# Altium schematic sheet IMX8_INTERFACE.SchDoc
size 594 x 420 mm; SheetNumber: 2; SheetTotal: 12
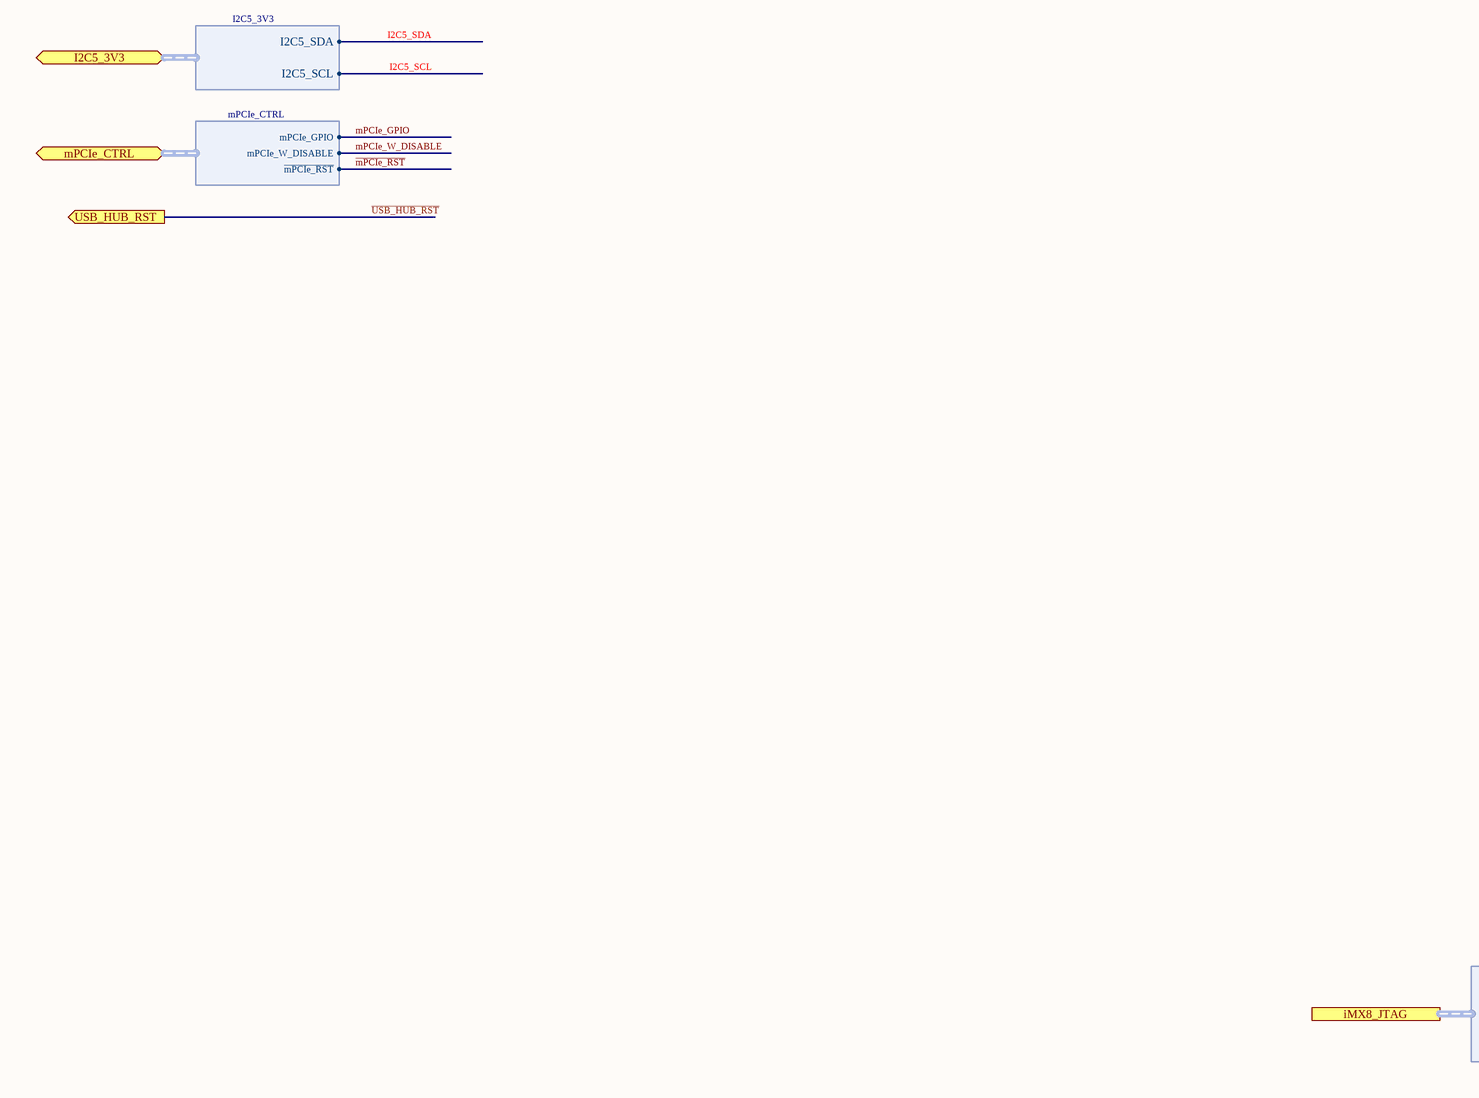
[diagram p0: IMX8_INTERFACE.SchDoc, bottom left]
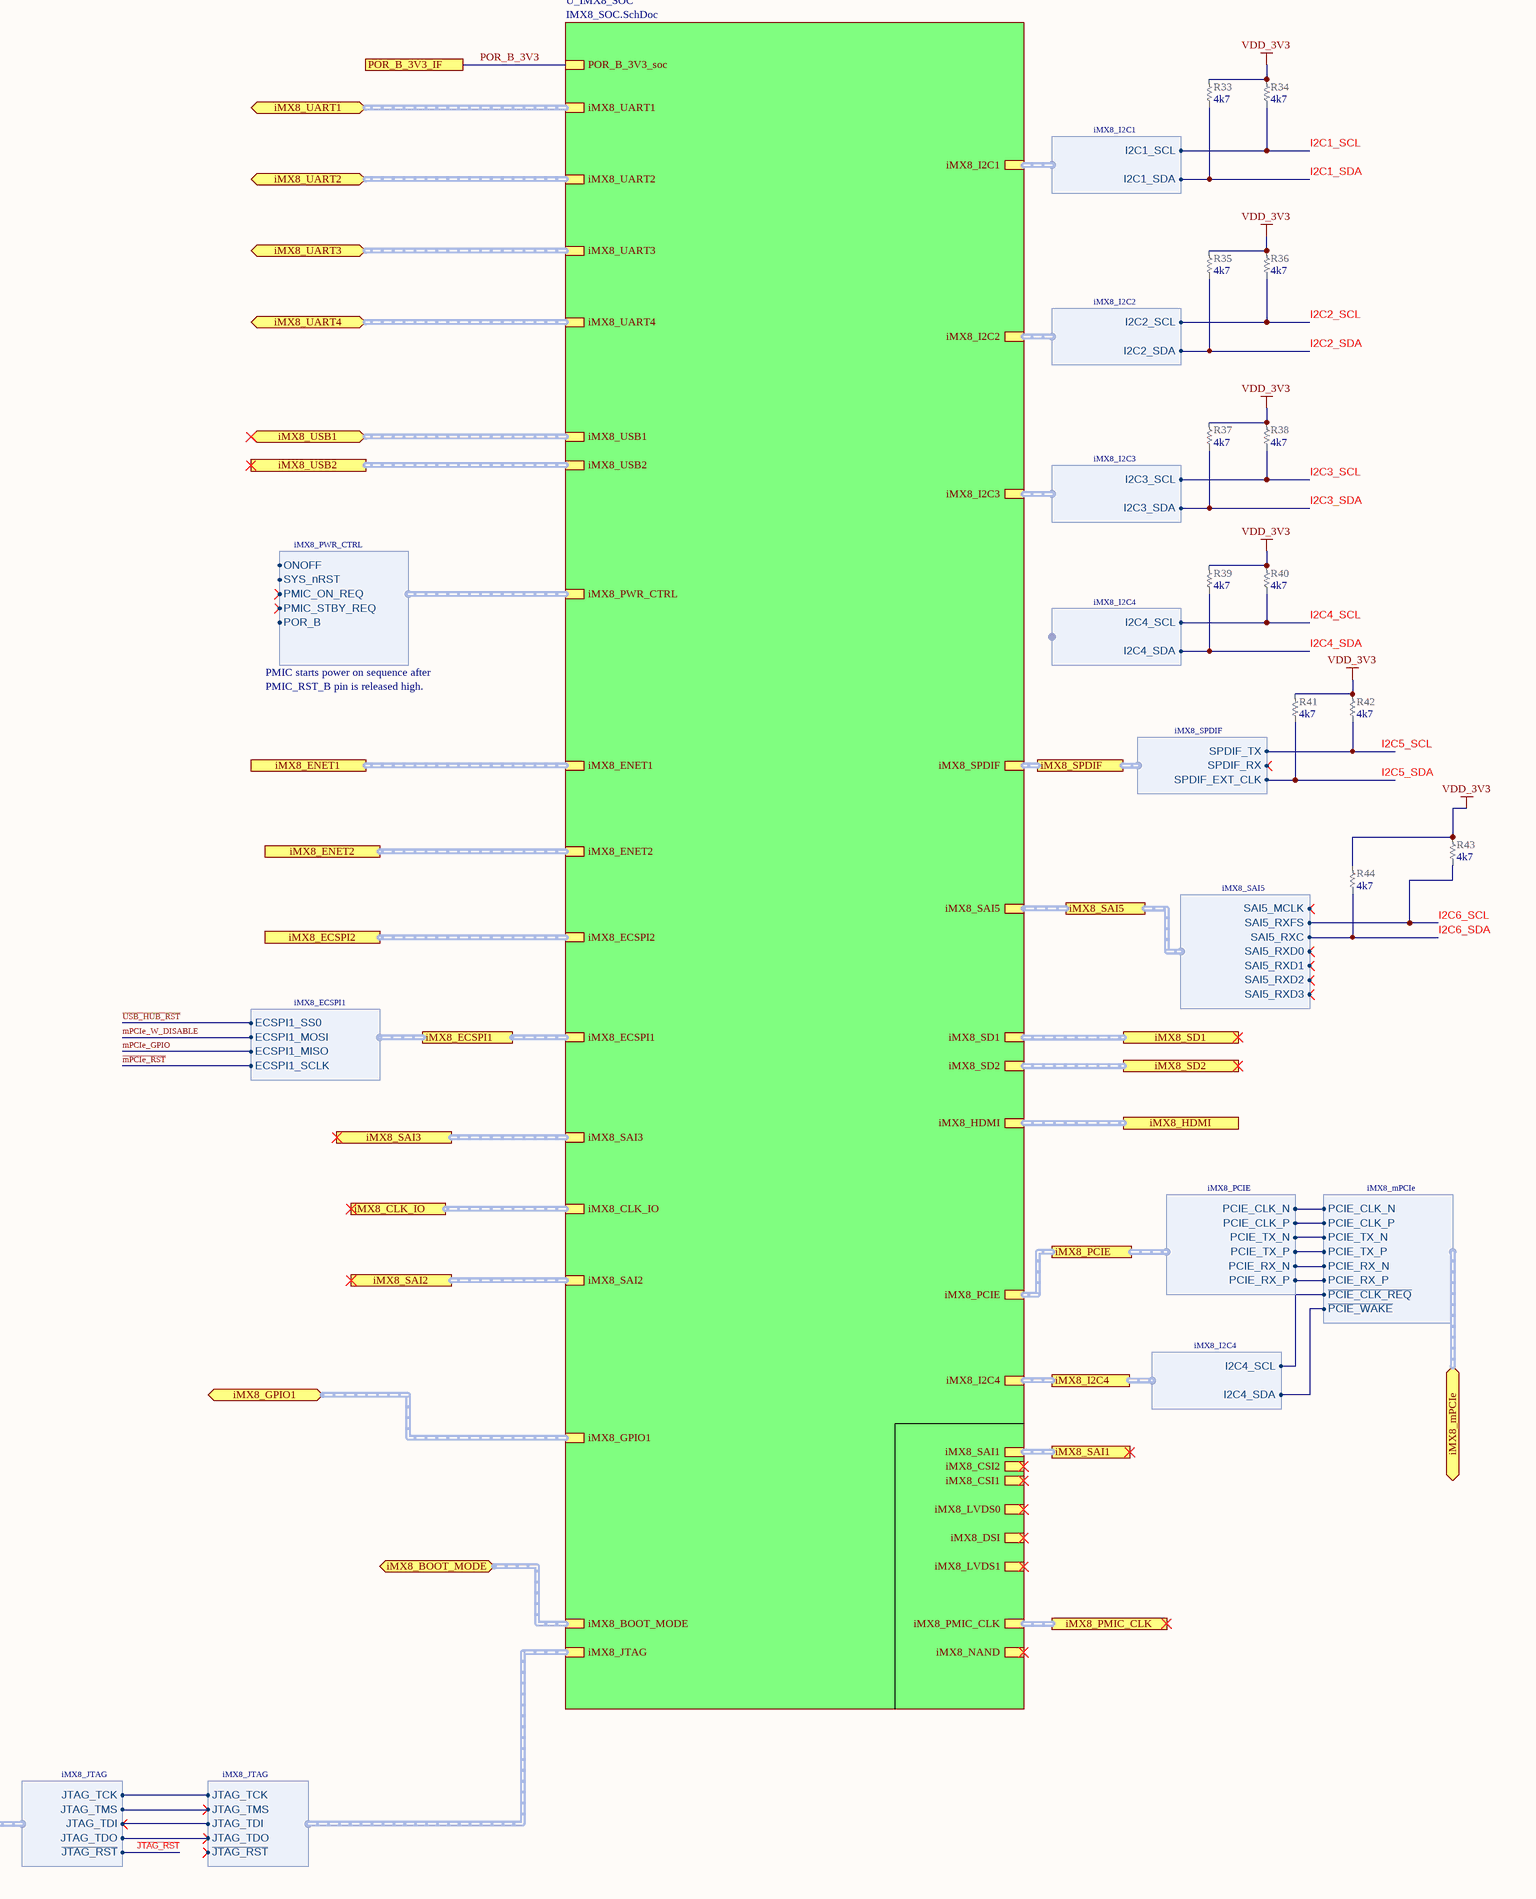
[diagram p1: IMX8_INTERFACE.SchDoc, bottom right]

## Parts
R33  value 4k7  [RES_0201_UN1Q]  (hidden comment: RES_0201_4k7)
R34  value 4k7  [RES_0201_UN1Q]  (hidden comment: RES_0201_4k7)
R35  value 4k7  [RES_0201_UN1Q]  (hidden comment: RES_0201_4k7)
R36  value 4k7  [RES_0201_UN1Q]  (hidden comment: RES_0201_4k7)
R37  value 4k7  [RES_0201_UN1Q]  (hidden comment: RES_0201_4k7)
R38  value 4k7  [RES_0201_UN1Q]  (hidden comment: RES_0201_4k7)
R39  value 4k7  [RES_0201_UN1Q]  (hidden comment: RES_0201_4k7)
R40  value 4k7  [RES_0201_UN1Q]  (hidden comment: RES_0201_4k7)
R41  value 4k7  [RES_0201_UN1Q]  (hidden comment: RES_0201_4k7)
R42  value 4k7  [RES_0201_UN1Q]  (hidden comment: RES_0201_4k7)
R43  value 4k7  [RES_0201_UN1Q]  (hidden comment: RES_0201_4k7)
R44  value 4k7  [RES_0201_UN1Q]  (hidden comment: RES_0201_4k7)

## Sub-sheets
U_IMX8_SOC = IMX8_SOC.SchDoc: iMX8_USB1 (harness iMX8_USB1), iMX8_USB2 (harness iMX8_USB2), iMX8_SD1 (harness iMX8_SD1), iMX8_SD2 (harness iMX8_SD2), iMX8_NAND (harness iMX8_PCIE), iMX8_PCIE (harness iMX8_PCIE), iMX8_DSI (harness iMX8_DSI), iMX8_LVDS0 (harness iMX8_LVDS0), iMX8_LVDS1 (harness iMX8_LVDS1), iMX8_CSI1 (harness iMX8_CSI1), iMX8_CSI2 (harness iMX8_CSI2), iMX8_HDMI (harness iMX8_HDMI), iMX8_UART1 (harness iMX8_UART1), iMX8_UART2 (harness iMX8_UART2), iMX8_UART3 (harness iMX8_UART3), iMX8_UART4 (harness iMX8_UART4), iMX8_I2C1 (harness iMX8_I2C1), iMX8_I2C2 (harness iMX8_I2C2), iMX8_I2C3 (harness iMX8_I2C3), iMX8_SAI1 (harness iMX8_SAI1), iMX8_SAI2 (harness iMX8_SAI2), iMX8_SAI5 (harness iMX8_SAI5), iMX8_SAI3 (harness iMX8_SAI3), iMX8_ENET1, iMX8_ENET2 (harness iMX8_ENET), iMX8_ECSPI2 (harness iMX8_ECSPI2), iMX8_GPIO1 (harness iMX8_GPIO1), iMX8_SPDIF (harness iMX8_SPDIF), iMX8_BOOT_MODE (harness iMX8_BOOT_MODE), iMX8_JTAG (harness iMX8_JTAG), iMX8_PMIC_CLK (harness iMX8_PMIC_CLK), iMX8_PWR_CTRL (harness iMX8_PWR_CTRL), iMX8_I2C4 (harness iMX8_I2C4), iMX8_ECSPI1 (harness iMX8_ECSPI1), POR_B_3V3_soc, iMX8_CLK_IO (harness iMX8_CLK_IO_sub)

## Ports
I2C5_3V3 (bidir, harness I2C5_3V3), iMX8_BOOT_MODE (bidir, harness iMX8_BOOT_MODE), iMX8_CLK_IO (harness iMX8_CLK_IO_sub), iMX8_ECSPI1 (harness iMX8_ECSPI1), iMX8_ECSPI2 (harness iMX8_ECSPI2), iMX8_ENET1, iMX8_ENET2 (harness iMX8_ENET), iMX8_GPIO1 (bidir, harness iMX8_GPIO1), iMX8_HDMI (harness iMX8_HDMI), iMX8_I2C4 (harness iMX8_I2C4), iMX8_JTAG (harness iMX8_JTAG), iMX8_mPCIe (bidir, harness iMX8_mPCIe), iMX8_PCIE (harness iMX8_PCIE), iMX8_PMIC_CLK (harness iMX8_PMIC_CLK), iMX8_SAI1 (harness iMX8_SAI1), iMX8_SAI2 (harness iMX8_SAI2), iMX8_SAI3 (harness iMX8_SAI3), iMX8_SAI5 (harness iMX8_SAI5), iMX8_SD1 (harness iMX8_SD1), iMX8_SD2 (harness iMX8_SD2), iMX8_SPDIF (harness iMX8_SPDIF), iMX8_UART1 (bidir, harness iMX8_UART1), iMX8_UART2 (bidir, harness iMX8_UART2), iMX8_UART3 (bidir, harness iMX8_UART3), iMX8_UART4 (bidir, harness iMX8_UART4), iMX8_USB1 (bidir, harness iMX8_USB1), iMX8_USB2 (harness iMX8_USB2), mPCIe_CTRL (bidir, harness mPCIe_CTRL), POR_B_3V3_IF, USB_HUB_RST (out)

## Harnesses
iMX8_JTAG: JTAG_TCK, JTAG_TMS, JTAG_TDI, JTAG_TDO, ~{JTAG_RST}
iMX8_PWR_CTRL: ONOFF, POR_B, PMIC_ON_REQ, PMIC_STBY_REQ, SYS_nRST
iMX8_I2C1: I2C1_SCL, I2C1_SDA
iMX8_I2C2: I2C2_SCL, I2C2_SDA
iMX8_I2C3: I2C3_SCL, I2C3_SDA
iMX8_I2C4: I2C4_SCL, I2C4_SDA
iMX8_SAI5: SAI5_MCLK, SAI5_RXFS, SAI5_RXC, SAI5_RXD0, SAI5_RXD1, SAI5_RXD2, SAI5_RXD3
iMX8_SPDIF: SPDIF_TX, SPDIF_RX, SPDIF_EXT_CLK
I2C5_3V3: I2C5_SDA, I2C5_SCL
iMX8_PCIE: PCIE_CLK_N, PCIE_CLK_P, PCIE_TX_N, PCIE_TX_P, PCIE_RX_N, PCIE_RX_P
iMX8_mPCIe: PCIE_CLK_N, PCIE_CLK_P, PCIE_TX_N, PCIE_TX_P, PCIE_RX_N, PCIE_RX_P, ~{PCIE_CLK_REQ}, ~{PCIE_WAKE}
mPCIe_CTRL: mPCIe_GPIO, ~{mPCIe_RST}, mPCIe_W_DISABLE
iMX8_ECSPI1: ECSPI1_SS0, ECSPI1_MOSI, ECSPI1_MISO, ECSPI1_SCLK

## Nets
VDD_3V3: R33.2 R34.2 R35.2 R36.2 R37.2 R38.2 R39.2 R40.2 R41.2 R42.2 R43.2 R44.2
~{JTAG_RST}: port iMX8_JTAG.~{JTAG_RST}
~{mPCIe_RST}: port mPCIe_CTRL.~{mPCIe_RST}, port iMX8_ECSPI1.ECSPI1_SCLK
~{USB_HUB_RST}: port USB_HUB_RST, port iMX8_ECSPI1.ECSPI1_SS0
I2C1_SCL: R34.1 ; sheet U_IMX8_SOC/iMX8_I2C1.I2C1_SCL
I2C1_SDA: R33.1 ; sheet U_IMX8_SOC/iMX8_I2C1.I2C1_SDA
I2C2_SCL: R36.1 ; sheet U_IMX8_SOC/iMX8_I2C2.I2C2_SCL
I2C2_SDA: R35.1 ; sheet U_IMX8_SOC/iMX8_I2C2.I2C2_SDA
I2C3_SCL: R38.1 ; sheet U_IMX8_SOC/iMX8_I2C3.I2C3_SCL
I2C3_SDA: R37.1 ; sheet U_IMX8_SOC/iMX8_I2C3.I2C3_SDA
I2C4_SCL: R40.1 ; harness iMX8_I2C4.I2C4_SCL
I2C4_SDA: R39.1 ; harness iMX8_I2C4.I2C4_SDA
I2C5_SCL: R42.1 ; port iMX8_SPDIF.SPDIF_TX, port I2C5_3V3.I2C5_SCL
I2C5_SDA: R41.1 ; port iMX8_SPDIF.SPDIF_EXT_CLK, port I2C5_3V3.I2C5_SDA
I2C6_SCL: R43.1 ; port iMX8_SAI5.SAI5_RXFS
I2C6_SDA: R44.1 ; port iMX8_SAI5.SAI5_RXC
mPCIe_GPIO: port mPCIe_CTRL.mPCIe_GPIO, port iMX8_ECSPI1.ECSPI1_MISO
mPCIe_W_DISABLE: port mPCIe_CTRL.mPCIe_W_DISABLE, port iMX8_ECSPI1.ECSPI1_MOSI
POR_B_3V3: port POR_B_3V3_IF, sheet U_IMX8_SOC/POR_B_3V3_soc
(unnamed): port iMX8_JTAG.JTAG_TCK, sheet U_IMX8_SOC/iMX8_JTAG.JTAG_TCK
(unnamed): port iMX8_JTAG.JTAG_TMS, sheet U_IMX8_SOC/iMX8_JTAG.JTAG_TMS
(unnamed): port iMX8_JTAG.JTAG_TDI, sheet U_IMX8_SOC/iMX8_JTAG.JTAG_TDI
(unnamed): port iMX8_JTAG.JTAG_TDO, sheet U_IMX8_SOC/iMX8_JTAG.JTAG_TDO
(unnamed): port iMX8_I2C4.I2C4_SCL, port iMX8_mPCIe.~{PCIE_CLK_REQ}
(unnamed): port iMX8_I2C4.I2C4_SDA, port iMX8_mPCIe.~{PCIE_WAKE}
(unnamed): port iMX8_PCIE.PCIE_CLK_N, port iMX8_mPCIe.PCIE_CLK_N
(unnamed): port iMX8_PCIE.PCIE_CLK_P, port iMX8_mPCIe.PCIE_CLK_P
(unnamed): port iMX8_PCIE.PCIE_TX_N, port iMX8_mPCIe.PCIE_TX_N
(unnamed): port iMX8_PCIE.PCIE_TX_P, port iMX8_mPCIe.PCIE_TX_P
(unnamed): port iMX8_PCIE.PCIE_RX_N, port iMX8_mPCIe.PCIE_RX_N
(unnamed): port iMX8_PCIE.PCIE_RX_P, port iMX8_mPCIe.PCIE_RX_P

## Buses and harness runs
harness port iMX8_BOOT_MODE = sheet U_IMX8_SOC/iMX8_BOOT_MODE
harness port iMX8_CLK_IO = sheet U_IMX8_SOC/iMX8_CLK_IO
harness port iMX8_ECSPI1 = sheet U_IMX8_SOC/iMX8_ECSPI1
harness port iMX8_ECSPI2 = sheet U_IMX8_SOC/iMX8_ECSPI2
harness port iMX8_ENET1 = sheet U_IMX8_SOC/iMX8_ENET1
harness port iMX8_ENET2 = sheet U_IMX8_SOC/iMX8_ENET2
harness port iMX8_GPIO1 = sheet U_IMX8_SOC/iMX8_GPIO1
harness port iMX8_HDMI = sheet U_IMX8_SOC/iMX8_HDMI
harness port iMX8_I2C4 = sheet U_IMX8_SOC/iMX8_I2C4
harness port iMX8_PCIE = sheet U_IMX8_SOC/iMX8_PCIE
harness port iMX8_PMIC_CLK = sheet U_IMX8_SOC/iMX8_PMIC_CLK
harness port iMX8_SAI1 = sheet U_IMX8_SOC/iMX8_SAI1
harness port iMX8_SAI2 = sheet U_IMX8_SOC/iMX8_SAI2
harness port iMX8_SAI3 = sheet U_IMX8_SOC/iMX8_SAI3
harness port iMX8_SAI5 = sheet U_IMX8_SOC/iMX8_SAI5
harness port iMX8_SD1 = sheet U_IMX8_SOC/iMX8_SD1
harness port iMX8_SD2 = sheet U_IMX8_SOC/iMX8_SD2
harness port iMX8_SPDIF = sheet U_IMX8_SOC/iMX8_SPDIF
harness port iMX8_UART1 = sheet U_IMX8_SOC/iMX8_UART1
harness port iMX8_UART2 = sheet U_IMX8_SOC/iMX8_UART2
harness port iMX8_UART3 = sheet U_IMX8_SOC/iMX8_UART3
harness port iMX8_UART4 = sheet U_IMX8_SOC/iMX8_UART4
harness port iMX8_USB1 = sheet U_IMX8_SOC/iMX8_USB1
harness port iMX8_USB2 = sheet U_IMX8_SOC/iMX8_USB2

## Notes on the sheet
- PMIC starts power on sequence after
- PMIC_RST_B pin is released high.
- DWG NO:
- REV:
- THIS DOCUMENT AND THE DATA DISCLOSED HEREIN OR
- HEREWITH IS THE PROPERTY OF ALTIUM LIMITED AND MAY
- BE FREELY DISTRIBUTED IN WHOLE. NO RIGHTS ARE
- RESERVED OR EXPRESS OR IMPLIED WARANTEE GIVEN.
- REVISION
- DESCRIPTION
- DATE
- APPROVED
- ENG:
- APPROVALS
- PROJECT
- DSN:
- CHK:
- REFERENCE DOCUMENTS
- PROJECT REVISION:
- TITLE
- DOCUMENT REVISION:
- DESIGN ITEM:
- BOM:
- FAB DWG:
- PCB DWG:
- ASSY DWG:
- SCALE:
- A2
- SIZE
- CAGE CODE
- FILE NAME
- DWG NO.
- SHEET
- OF
- REV

## Library data of the parts
R33-R44 = CMP-001-000475-13: RES; Part Number: RC0201FR-074K7L; Manufacturer: Yageo Group; Power Rating: 1/20W; Sort order: 322; HasBeenBuilt: TBD; Alternative component: Allowed; Tolerance: 1%; System: RLC; Package: 0201; ClassName: SMALL; ComponentLink1Description: 1_Datasheet; ComponentLink2Description: 2_Product page; ComponentLink3Description: 3_X-information; ComponentLink4Description: 4_X-information; Creation date: 20190101; Source: RLC_UN1Q.SchLib; Manufacturer Part Number: RC0201FR-074K7L; Component Type: Resistor